# EAGLE design progESP (EAGLE 8.3.2)
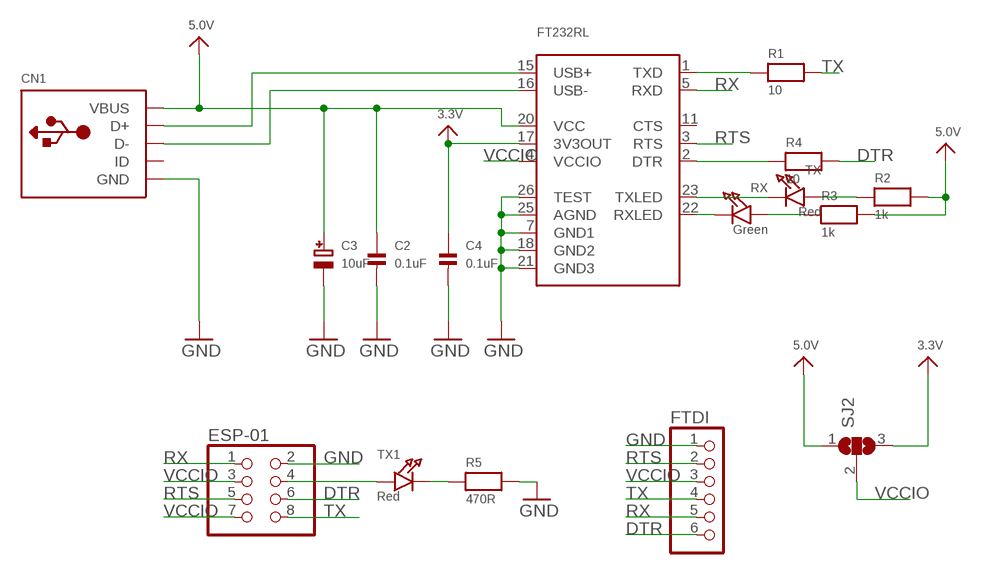
[diagram p0: schematic, sheet 1]

## Parts
C2  0.1uF  CAP_CERAMIC0805  [0805]
C3  10uF  CAP_TANTALUMA/3216_REFLOW  [EIA3216-18/A-R]
C4  0.1uF  CAP_CERAMIC0805  [0805]
CN1  USBMINIB  [USB-MINIB]
ESP-01  PINHD-2X4-ESP-01  [2X04]
FT232RL  FT232RLSSOP28  [SSOP28DB]
FTDI  PINHD-1X6  [1X06]
R1  10  RESISTOR0805  [0805]
R2  1k  RESISTOR0805  [0805]
R3  1k  RESISTOR0805  [0805]
R4  10  RESISTOR0805  [0805]
R5  470R  RESISTOR0805  [0805]
RX  Green  LED0805  [CHIPLED_0805]
SJ2  SJ2W  [SJ_2]
TX  Red  LED0805  [CHIPLED_0805]
TX1  Red  LED0805  [CHIPLED_0805]

## Nets
3.3V: C4.1 FT232RL.17(3V3OUT) SJ2.3
5.0V: C2.1 C3.+ CN1.VBUS FT232RL.20(VCC) R2.2 R3.2 SJ2.1
DTR: ESP-01.6 FTDI.6 R4.2
GND: C2.2 C3.- C4.2 CN1.GND ESP-01.2 FT232RL.7(GND1) FT232RL.18(GND2) FT232RL.21(GND3) FT232RL.25(AGND) FT232RL.26(TEST) FTDI.1 R5.2
N$1: FT232RL.2(DTR) R4.1
N$2: CN1.D+ FT232RL.15(USB+)
N$3: CN1.D- FT232RL.16(USB-)
N$4: FT232RL.23(TXLED) TX.C
N$5: FT232RL.1(TXD) R1.1
N$6: FT232RL.22(RXLED) RX.C
N$7: R3.1 RX.A
N$8: R2.1 TX.A
N$9: ESP-01.4 TX1.A
N$10: R5.1 TX1.C
RTS: ESP-01.5 FT232RL.3(RTS) FTDI.2
RX: ESP-01.1 FT232RL.5(RXD) FTDI.5
TX: ESP-01.8 FTDI.4 R1.2
VCCIO: ESP-01.3 ESP-01.7 FT232RL.4(VCCIO) FTDI.3 SJ2.2
Unconnected: CN1.ID FT232RL.11(CTS)

## Library data of the parts
C2 C4 = microbuilder:CAP_CERAMIC: Ceramic Capacitors 0402 - 0402 Surface Mount Capacitors 16pF 50V 5% [Digikey: 445-4899-2-ND] 18pF 50V 5% [Digikey: 490-1281-2-ND] 22pF 50V 5% [Digikey: 490-1283-2-ND] 68pF 50V 5% [Digikey: 490-1289-2-ND] 0.1uF 10V 10% [Digikey: 490-1318-2-ND] 1.0uF 6.3V 10% [Digikey: 490-1320-2-ND] 0603 - 0603 Surface Mount Capacitors 16 pF 50V 5% [Digikey: 445-5051-2-ND] 22 pF 50V [Digikey: PCC220ACVTR-ND] 33 pF 50V 5% [Digikey: 490-1415-1-ND] 56pF 50V 5% [Digikey: 490-1421-1-ND] 220pF 50V 5% [Digikey: 445-1285-1-ND] 680 pF 50V 2200 pF 50V 5% C0G [Digikey: 445-1297-1-ND] 5600 pF 100V 5% X7R [Digikey: 478-3711-1-ND] 0.1 µF 25V 10% [Digikey: PCC2277TR-ND] 0.22 µF 16V 10% X7R [Digikey: 445-1318-1-ND] 1.0 µF 25V 10% [Digikey: 445-5146-2-ND] 0603 - RF Specific 3pF 250V +/-0.1pF RF [Digikey: 712-1347-1-ND] 18 pF 250V 5% [Digikey: 478-3505-1-ND or 712-1322-1-ND] 56 pF 250V 5% C0G RF [Digikey: 490-4867-1-ND] 68 pF 250V RF [Digikey: 490-4868-1-ND] 0805 - 0805 Surface Mount Capacitors 220 pF 250V 2% RF Ceramic Capacitor [Digikey: 712-1398-1-ND] 1000 pF 50V 2% NP0 Ceramic Capacitor [Digikey: 478-3760-1-ND] 0.1 µF 25V 10% Ceramic Capacitor [Digikey: PCC1828TR-ND] 1.0 µF 16V 10% Ceramic Capacitor[Digikey: 490-1691-2-ND] 10.0 µF 10V 10% Ceramic Capacitor[Digikey: 709-1228-1-ND] 10.0 uF 16V 10% Ceramic Capacitor [Digikey: 478-5165-2-ND] 47 uF 6.3V 20% Ceramic Capacitor [Digikey: 587-1779-1-ND or 399-5506-1-ND] 1206 - 1206 Surface Mount Capacitors 47uF 10V 20% Ceramic Capacitor [Digikey: 490-5528-1-ND or 399-5508-1-ND or 445-6010-1-ND]
C3 = microbuilder:CAP_TANTALUM: Tantalum Capacitors Wave footprints have larger pads and are meant to be used for hand soldering. Reflow footprints are optimised for solder paste and a reflow oven. EIA3216-18/A-[R/W] - Size A / 3216-18 / 1206 footprint 4.7µF 25V 10% Tantalum Capacitor 10µF 16V 10% Tantalum Capacitor [Digikey: 495-2236-2-ND] EIA3528-21/B-[R/W] - Size B / 3528-21 47µF 10V 10% Tantalum Capactior [Digikey: 495-2216-1-ND] EIA6032-28/C-[R/W] - Size C / 6032-28 10µF 35V 20% Tantalum Capacitor [Digikey: 495-2285-1-ND] 100µF 16V 10% Tantalum Capactior [Digikey: 399-5214-1-ND]
CN1 = adafruit:USB: USB Connectors USBMINIB - Surface Mount Female Mini-B USB Connector 4UConnector: 06564 By microbuilder.eu Thru-hole RA Female Mini-B USB Connector 4UConnector: 18732 By ladyada.net
ESP-01 = adafruit:PINHD-2X4-ESP-01: PIN HEADER
FT232RL = microbuilder:FT232RL: FTDI FT232RL USB TO RS232 Converter Digikey: 768-1007-1-ND
FTDI = adafruit:PINHD-1X6: PIN HEADER
R1-R5 = microbuilder:RESISTOR: Resistors 0402 - 0402 Surface Mount Package 22 Ohm 1% 1/16W [Digikey: 311-22.0LRTR-ND] 33 Ohm 5% 1/16W 1.0K 5% 1/16W 1.5K 5% 1/16W 2.0K 1% 1/16W 10.0K 1% 1/16W [Digikey: 311-10.0KLRTR-ND] 10.0K 5% 1/16W [Digikey: RMCF0402JT10K0TR-ND] 12.1K 1% 1/16W [Digikey: 311-22.0LRTR-ND] 100.0K 5% 1/16W 0603 - 0603 Surface Mount Package 0 Ohm 1/10 Watt 1% Resistor 15 Ohm 1/10 Watt 1% Resistor 33 Ohm 1/10 Watt 1% Resistor 49.9 Ohm 1/10 Watt 1% Resistor 100 Ohm 1/10 Watt 1% Resistor 150 Ohm 1/10 Watt 1% Resistor 240 Ohm 1/10 Watt 1% Resistor 390 Ohm 1/10 Watt 1% Resistor 560 Ohm 1/10 Watt 1% Resistor 680 Ohm 1/10 Watt 1% Resistor 750 Ohm 1/10 Watt 1% Resistor 1.0K Ohm 1/10 Watt 1% Resistor 1.5K Ohm 1/10 Watt 1% Resistor 2.0K Ohm 1/10 Watt 1% Resistor 2.2K Ohm 1/10 Watt 1% Resistor 3.3K Ohm 1/10 Watt 1% Resistor 4.7K Ohm 1/10 Watt 1% Resistor 10.0K Ohm 1/10 Watt 1% Resistor 12.0K Ohm 1/10 Watt 1% Resistor 12.1K Ohm 1/10 Watt 1% Resistor 20.0K Ohm 1/10 Watt 1% Resistor 33.0K Ohm 1/10 Watt 1% Resistor 100.0K Ohm 1/10 Watt 1% Resistor 0805 - 0805 Surface Mount Package 0 Ohm 1/8 Watt 1% Resistor 33 Ohm 1/8 Watt 1% Resistor 100 Ohm 1/8 Watt 1% Resistor 150 Ohm 1/8 Watt 1% Resistor 200 Ohm 1/8 Watt 1% Resistor 240 Ohm 1/8 Watt 1% Resistor 330 Ohm 1/8 Watt 1% Resistor 390 Ohm 1/8 Watt 1% Resistor 470 Ohm 1/8 Watt 1% Resistor 1.0K Ohm 1/8 Watt 1% Resistor 1.5K Ohm 1/8 Watt 1% Resistor 2.0K Ohm 1/8 Watt 1% Resistor 4.7K Ohm 1/8 Watt 1% Resistor 5.1K Ohm 1/8 Watt 1% Resistor 5.6K Ohm 1/8 Watt 1% Resistor 10.0K Ohm 1/8 Watt 1% Resistor 22.0K Ohm 1/8 Watt 1% Resistor 33.0K Ohm 1/8 Watt 1% Resistor 100K Ohm 1/8 Watt 1% Resistor 1206 - 1206 Surface Mount Package 2012 - 2010 Surface Mount Package 0.11 Ohm 1/2 Watt 1% Resistor - Digikey: RHM.11UCT-ND
RX TX TX1 = microbuilder:LED: LED 0603 - 0603 Surface Mount Package 2mA: Green LED - Low Power (3.9mcd, 2ma, 1.7Vf) - Digikey: 475-2709-2-ND Orange LED - Low Power (9.8mcd, 2ma, 1.8Vf) - Digikey: 475-1194-2-ND Red LED - Low Power (5mcd, 2ma, 1.8Vf) - Digikey: 475-1195-2-ND Yellow LED - Low Power (7mcd, 2ma, 1.8Vf) - Digikey: 475-1196-2-ND 5mA: Blue LED - Low Power (17mcd, 5ma, 2.9Vf) - Digikey: LNJ937W8CRACT-ND 0805 - 0805 Surface Mount Package 2mA: Red LED (8.8mcd, 2mA, 1.8Vf, Clear) - Low Power [Digikey: 475-2510-1-ND] Green LED (5mcd, 2mA, 1.8Vf, Clear) - Low Power [Digikey: 475-2730-1-ND] Yellow LED (11.3mcd, 2mA, 1.8Vf, Clear) - Low Power [Digikey: 475-2555-1-ND] 20mA: Red LED (104mcd, 20mA, Diffused) - LS R976 [Digikey: 475-1278-6-ND] Red LED (12mcd, 20mA, 2.0Vf, Clear) - APT2012EC [Digikey: 754-1128-1-ND] Green LED (15mcd, 20mA, 2.2Vf, Clear) - APT2012GC [Digikey: 754-1131-1-ND] Orange LED (160mcd, 20mA, 2.1Vf, Clear) - APT2012SECK [Digikey: 754-1130-1-ND] 1206 - 1206 Surface Mount Package Green LED (26mcd, 20mA, Diffused) - LG N971 [Digikey: 475-1407-6-ND] Red LED (15mcd, 20mA, Diffused) - LH N974 [Digikey: 475-1416-6-ND]
SJ2 = jumper:SJ2W: SMD solder JUMPER

## Board
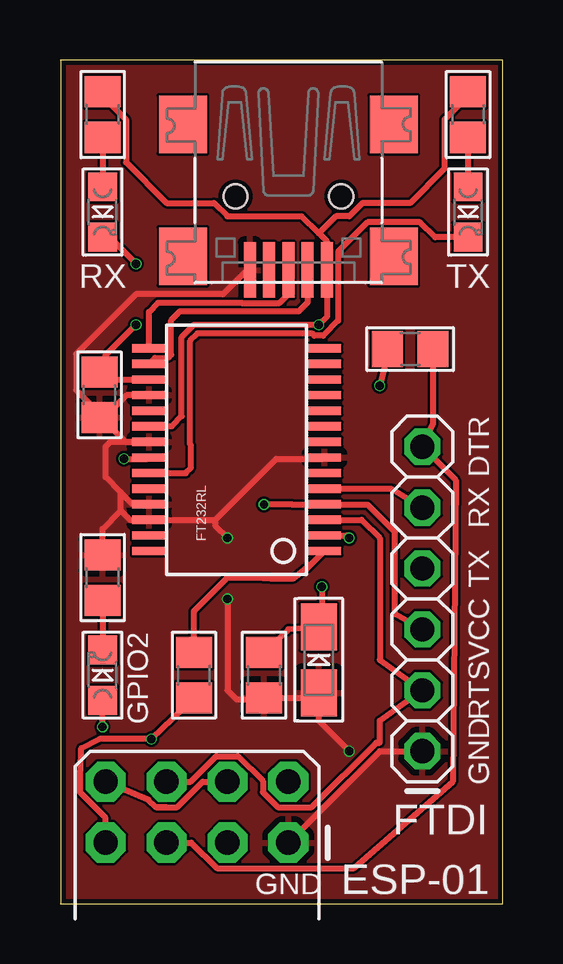
[diagram p1: board, top side]
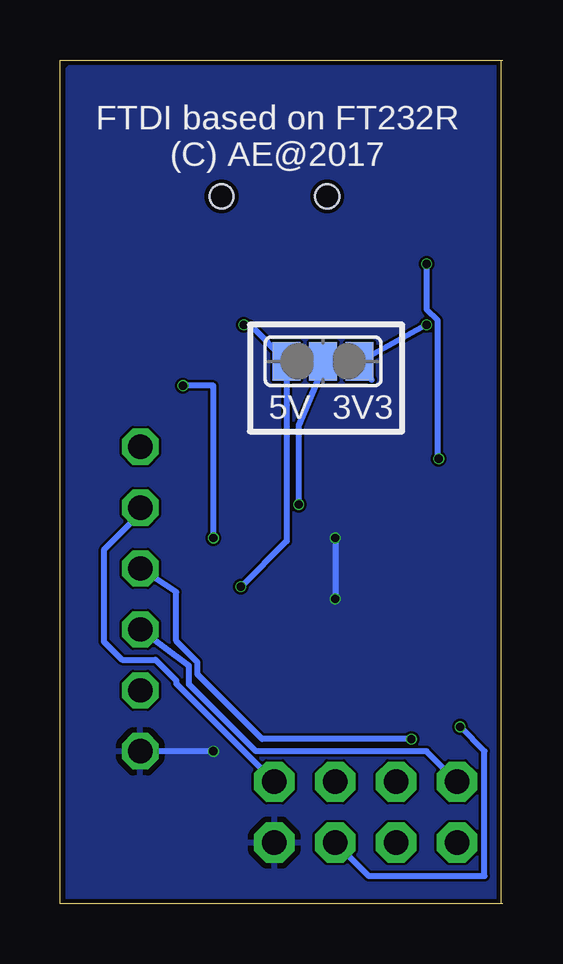
[diagram p2: board, bottom side, seen from below]

Size 18.47 x 35.17 mm. Coordinates in mm from the lower left corner, seen from the top.
Outline: 0,0 0.05,0
Outline: 0.05,0 18.47,0 18.47,35.17 0.05,35.17
Outline: 0.05,35.17 0,35.17
Outline: 0.05,0 0.05,35.17
Copper layers (1*16): Top 0.035mm / dielectric 1.5mm / Bottom 0.035mm
Design rules "aisler_go_2layer": minimum track width 0.1mm, minimum drill 0.2mm, track to track 0.1mm, track to pad 0.1mm, pad to pad 0.1mm, via to via 0.1mm, smd to smd 0.1mm, copper to edge 0.2mm, drill to drill 0.21mm, minimum pad ring 0.25mm, minimum via ring 0.05mm, stop-mask expansion 0.01mm, vias tented up to drill 0mil, thermal gap 10mil

### Footprints (pad centres in the part's own frame; a part is rotated, then mirrored left to right if it is on the bottom)
0805 = smd 1.3 x 1.5: 1 -0.95,0; 2 0.95,0
EIA3216-18/A-R = smd 1.95 x 1.5: + 1.375,0; - -1.375,0
USB-MINIB = smd 0.5 x 2.308: D+ 0,4.064; D- -0.8,4.064; GND 1.6,4.064; ID 0.8,4.064; VBUS -1.6,4.064 | smd 2 x 2.4: GND1 -4.4,-2; GND2 -4.4,3.5; GND3 4.4,3.5; GND4 4.4,-2 | hole 1: -2.2,1; 2.2,1
2X04 = drill 1.016 pad 1.676 octagon: 1 -3.81,-1.27; 2 -3.81,1.27; 3 -1.27,-1.27; 4 -1.27,1.27; 5 1.27,-1.27; 6 1.27,1.27; 7 3.81,-1.27; 8 3.81,1.27
SSOP28DB = smd 0.348 x 1.397: 1 -4.225,-3.656; 2 -3.575,-3.656; 3 -2.925,-3.656; 4 -2.275,-3.656; 5 -1.625,-3.656; 6 -0.975,-3.656; 7 -0.325,-3.656; 8 0.325,-3.656; 9 0.975,-3.656; 10 1.625,-3.656; 11 2.275,-3.656; 12 2.925,-3.656; 13 3.575,-3.656; 14 4.225,-3.656; 15 4.225,3.656; 16 3.575,3.656; 17 2.925,3.656; 18 2.275,3.656; 19 1.625,3.656; 20 0.975,3.656; 21 0.325,3.656; 22 -0.325,3.656; 23 -0.975,3.656; 24 -1.625,3.656; 25 -2.275,3.656; 26 -2.925,3.656; 27 -3.575,3.656; 28 -4.225,3.656
1X06 = drill 1.016 octagon: 1 -6.35,0; 2 -3.81,0; 3 -1.27,0; 4 1.27,0; 5 3.81,0; 6 6.35,0
CHIPLED_0805 = smd 1.2 x 1.2: A 0,-1.05; C 0,1.05
SJ_2 = smd 1.168 x 1.6: 1 -1.524,0; 2 0,0; 3 1.524,0

### Placement (x,y rotation side)
C2  8.51,9.52 270 top
C3  10.79,10.16 90 top
C4  1.65,21.21 270 top
CN1  9.52,30.48 180 top
ESP-01  5.71,3.81 180 top
FT232RL  7.37,18.92 90 top
FTDI  15.11,12.7 90 top
R1  5.59,9.52 270 top
R2  17.02,32.89 90 top
R3  1.78,32.89 90 top
R4  14.6,23.11 0 top
R5  1.78,13.59 90 top
RX  1.78,28.83 180 top
SJ2  7.49,22.61 0 bottom
TX  17.02,28.83 180 top
TX1  1.78,9.52 0 top

### Tracks (layer width: path | path; a pad name or v marks a point on that pad's centre or on a via)
3.3V  (via drill 0.35)
  Top 0.254: v3.17,24.13 1.9,22.86 1.9,22.41 C4.1 1.96,21.85 FT232RL.17
  Bottom 0.254: 5.46,21.84 SJ2.3 v3.17,24.13
5.0V  (via drill 0.35)
  Top 0.254: R3.2 1.78,33.66 2.75,32.69 2.75,30.9 4.44,29.21 6.42,29.21 6.98,28.65 10.08,28.65 10.79,27.94 | R2.2 17.02,33.66 16.04,32.69 16.04,30.65 14.6,29.21 12.62,29.21 12.07,28.65 11.51,28.65 10.79,27.94 | 10.79,27.94 11.12,27.61 CN1.VBUS 11.12,24.46 v10.79,24.13 5.59,24.13 5.08,23.62 5.08,20.32 4.66,19.9 FT232RL.20 | C2.1 9.52,11.43 C3.+ 10.92,11.66 v10.92,13.21
  Bottom 0.254: v10.79,24.13 10.54,24.13 SJ2.1 9.02,15.11 v10.92,13.21
DTR
  Top 0.254: R4.2 15.55,20 FTDI.6 16.51,17.65 16.38,5.08 12.27,1.47 6.54,1.47 5.48,2.54 ESP-01.6
GND  (via drill 0.35)
  Top 0.254: FT232RL.18 2.78,21.2 1.9,20.32 1.67,20.32 | FTDI.1 13.33,6.35 ESP-01.2 | 1.67,20.32 2.74,19.25 FT232RL.21 2.1,19.25 1.9,19.05 1.9,17.78 2.54,17.14 | CN1.GND 7.81,26.42 6.79,25.4 3.17,25.4 0.67,22.9 0.67,21.41 1.65,20.44 C4.2 1.67,20.32 | 10.34,18.6 FT232RL.7 10.97,18.54 9.02,18.54 6.47,16 | FT232RL.25 3.04,16.65 2.54,17.14 | 2.54,16.38 2.92,16 FT232RL.26 6.47,16 | 2.54,16.38 2.54,17.14 | v12.06,6.35 10.79,7.62 C3.- 10.58,8.57 C2.2 8.44,8.51 7.37,8.51 6.98,8.89 v6.98,12.7 | 6.47,16 6.47,15.75 v6.98,15.24 | R5.2 1.78,15.62 2.54,16.38
  Bottom 0.254: v12.06,6.35 FTDI.1 | v6.98,15.24 v6.98,12.7
  pour Top: 0.25,34.92 18.29,34.92 18.29,0.25 0.25,0.25
  pour Bottom: 0.38,34.92 18.03,34.92 18.16,34.8 18.16,0.25 18.16,0.13 0.25,0.13 0.25,34.92
N$1  (via drill 0.35)
  Top 0.254: FT232RL.2 11.96,15.35 v12.06,15.24 | v13.33,21.59 13.65,22.86 R4.1
  Bottom 0.254: v12.06,15.24 12.06,21.59 v13.33,21.59
N$2
  Top 0.254: FT232RL.15 3.71,24.66 4.09,25.05 7.57,25.05 7.58,25.03 9.16,25.03 9.52,25.4 CN1.D+
N$3
  Top 0.254: FT232RL.16 3.96,22.75 4.5,22.75 4.63,22.88 4.63,24.32 5.01,24.69 7.42,24.69 7.43,24.68 9.95,24.68 10.32,25.06 CN1.D-
N$4
  Top 0.254: TX.C 15.65,27.78 15.02,28.41 12.83,28.41 11.6,27.18 11.6,24.3 10.98,23.68 10.61,23.68 10.51,23.78 5.73,23.78 5.73,23.77 5.43,23.47 5.43,19.13 5.46,19.1 5.46,18.16 5.25,17.95 FT232RL.23
N$5
  Top 0.254: 10.54,14.22 10.29,13.97 | 10.54,14.22 FT232RL.1 | 10.54,14.22 9.74,13.56 8.76,13.56 | 8.76,13.56 8.48,13.56 | R1.1 5.59,12.19 6.98,13.59 8.74,13.59 8.76,13.56
N$6  (via drill 0.35)
  Top 0.254: RX.C 2.07,27.78 v3.17,26.67 | v2.67,18.54 3.65,18.54 FT232RL.22
  Bottom 0.254: v3.17,26.67 3.17,24.77 2.72,24.32 2.72,18.6 v2.67,18.54
N$7
  Top 0.254: R3.1 RX.A
N$8
  Top 0.254: R2.1 TX.A
N$9  (via drill 0.35)
  Top 0.254: v1.78,7.37 TX1.A
  Bottom 0.254: ESP-01.4 5.59,1.14 0.76,1.14 0.76,6.35 v1.78,7.37
N$10
  Top 0.254: R5.1 TX1.C
RTS
  Top 0.254: ESP-01.5 5.45,5.08 6.52,6.14 7.43,6.14 8.46,5.11 8.46,4.64 9.08,4.02 10.5,4.02 13.19,6.7 13.33,6.7 13.33,7.62 FTDI.2 13.33,10.16 13.33,15.24 12.58,16 FT232RL.3
RX
  Top 0.254: FT232RL.5 13.82,17.3 FTDI.5
  Bottom 0.254: ESP-01.1 13.62,9.17 13.62,9.3 14.48,10.16 15.88,10.16 16.64,10.92 16.64,14.73 15.11,16.26 FTDI.5
TX  (via drill 0.35)
  Top 0.254: ESP-01.8 1.9,3.57 0.84,4.64 0.84,5.52 0.86,5.54 0.89,6.48 1.65,6.86 v3.81,6.86 R1.2
  Bottom 0.254: v3.81,6.86 10.03,6.86 12.73,9.56 12.73,10.06 13.62,10.95 13.62,12.98 FTDI.4
VCCIO  (via drill 0.35)
  Top 0.254: v8.51,16.64 9.66,16.65 FT232RL.4 12.83,16.64 13.97,15.49 13.97,12.06 FTDI.3 | 4,4.02 4.44,4.02 | 4.44,4.02 4.89,4.02 5.95,5.08 ESP-01.3 | 4.44,4.02 4,4.02 | 4,4.02 3.68,4.33 ESP-01.7
  Bottom 0.254: v8.51,16.64 8.51,19.94 7.49,22.35 SJ2.2 6.1,22.61 | FTDI.3 13.08,9.91 13.08,9.14 10.29,6.35 3.17,6.35 ESP-01.7

### Text on the board
tNames: RX | TX | DTR | RX | TX | VCC | GPIO2 | RTS | GND | GND
bNames: FTDI based on FT232R / (C) AE@2017 | 3V3 | 5V